# EAGLE schematic FranKinksTides (EAGLE 7.2.0)

## Sheet 1 of 7
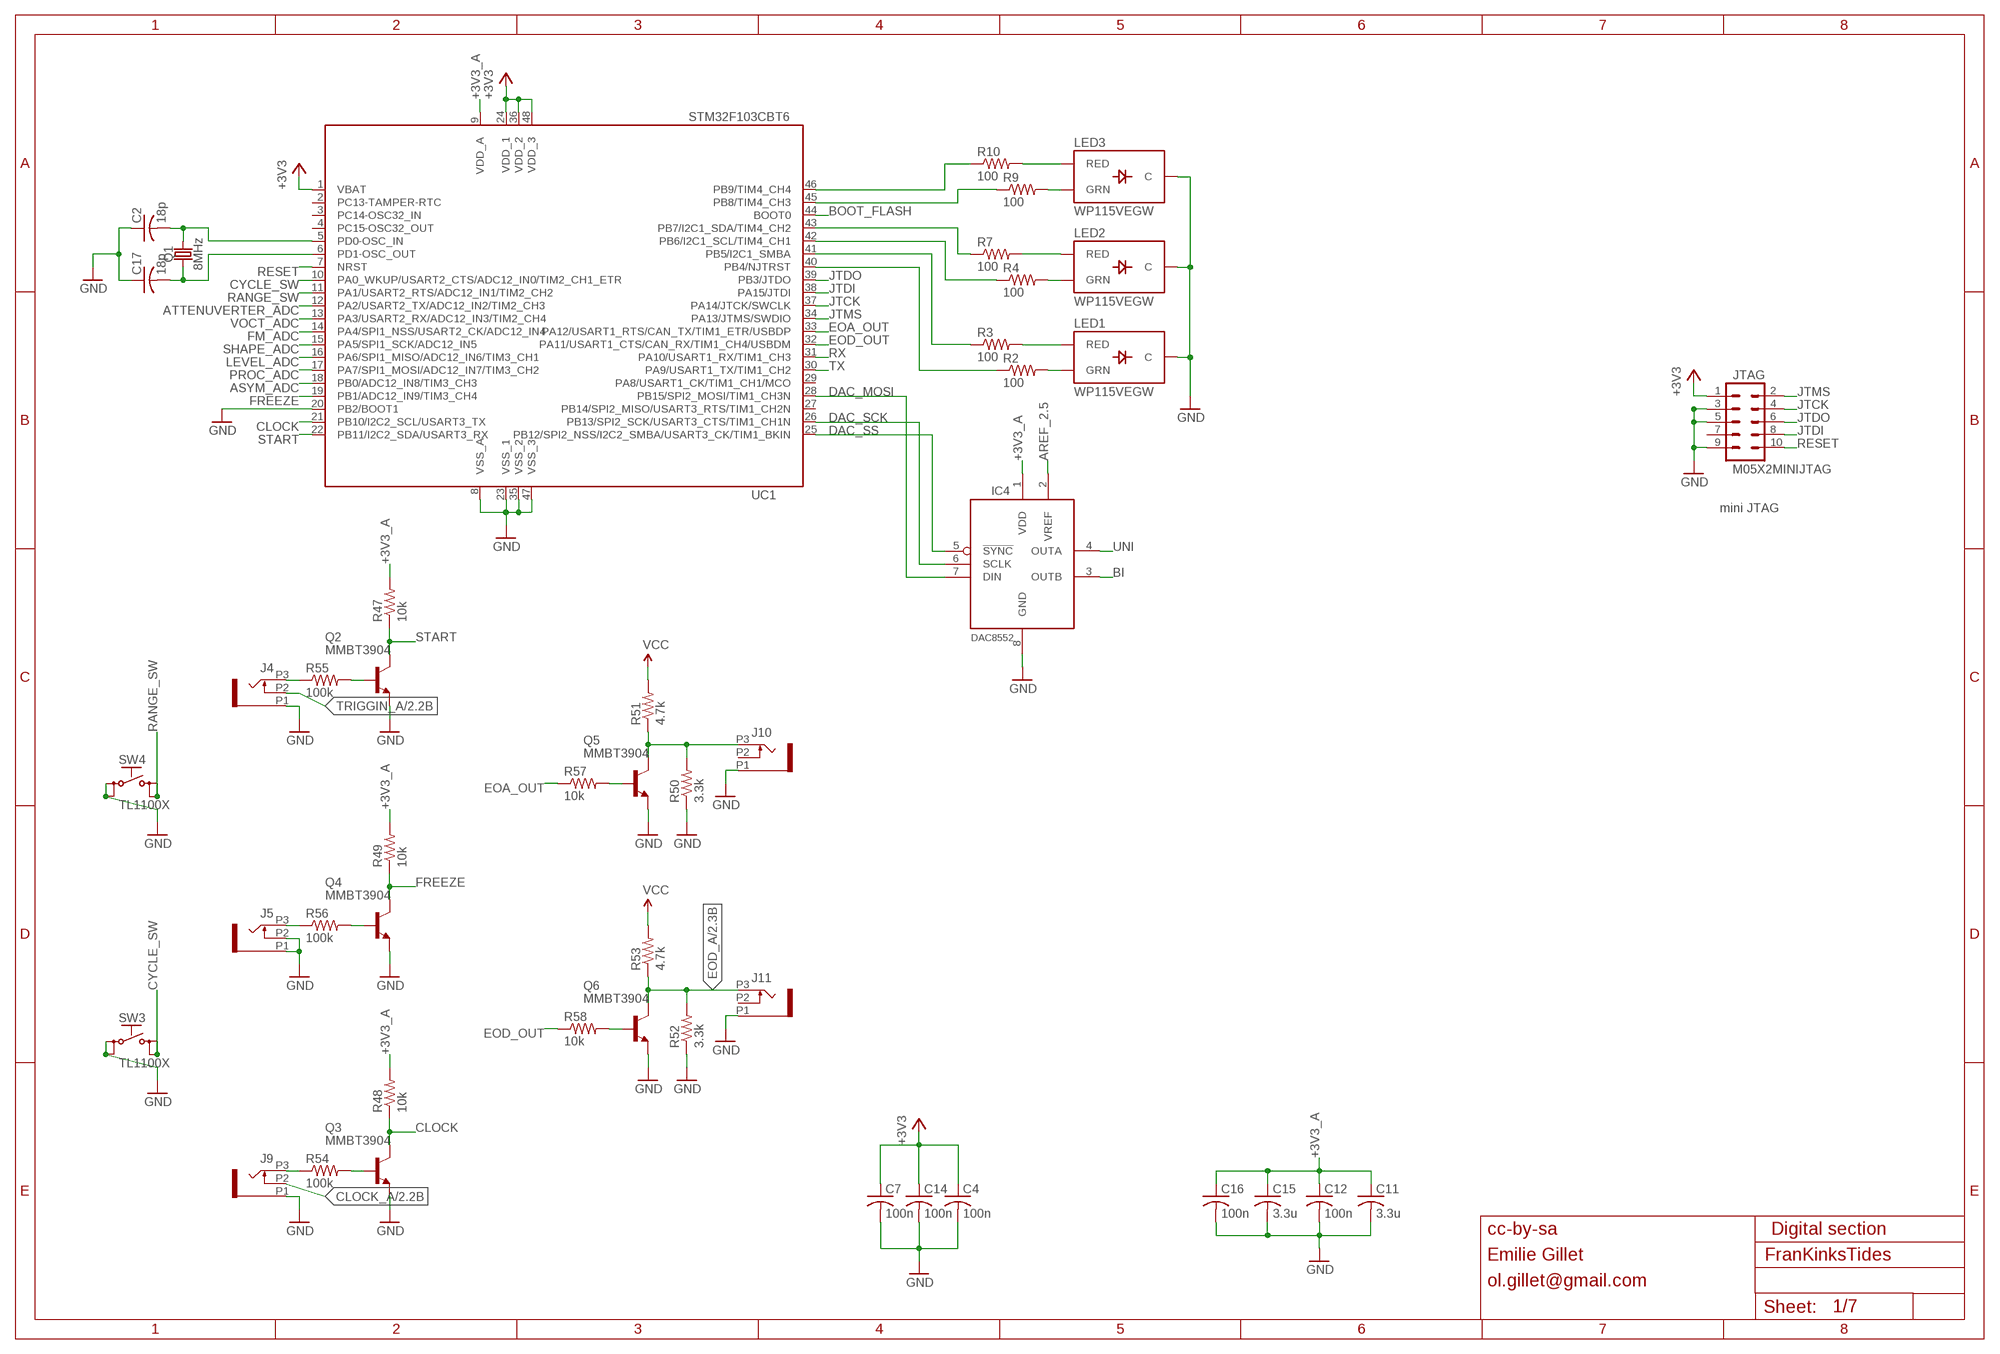
[diagram p0: schematic, sheet 1]

### Parts
C2  18p  C-USC0603  [C0603]
C4  100n  C-USC0603  [C0603]
C7  100n  C-USC0603  [C0603]
C11  3.3u  C-USC0603  [C0603]
C12  100n  C-USC0603  [C0603]
C14  100n  C-USC0603  [C0603]
C15  3.3u  C-USC0603  [C0603]
C16  100n  C-USC0603  [C0603]
C17  18p  C-USC0603  [C0603]
IC4  DAC8552  [MSOP-8]
J4  PJ301_GUI6  [OG-PJ301_VARIATIONS_WQP_PJ_301M6]
J5  PJ301_GUI6  [OG-PJ301_VARIATIONS_WQP_PJ_301M6]
J9  PJ301_GUI6  [OG-PJ301_VARIATIONS_WQP_PJ_301M6]
J10  PJ301_GUI6  [OG-PJ301_VARIATIONS_WQP_PJ_301M6]
J11  PJ301_GUI6  [OG-PJ301_VARIATIONS_WQP_PJ_301M6]
JTAG  M05X2MINIJTAG  [2X5-1.27]
LED1  WP115VEGW  LED-BICOLOR-THROUGHHOLE  [LED-BICOLOR-THROUGHHOLE]
LED2  WP115VEGW  LED-BICOLOR-THROUGHHOLE  [LED-BICOLOR-THROUGHHOLE]
LED3  WP115VEGW  LED-BICOLOR-THROUGHHOLE  [LED-BICOLOR-THROUGHHOLE]
Q1  8MHz  CRYSTAL-8MHZSMD-HC49UP  [HC49UP]
Q2  MMBT3904  MMBT3904LT1-NPN-SOT23-BEC  [SOT23-BEC]
Q3  MMBT3904  MMBT3904LT1-NPN-SOT23-BEC  [SOT23-BEC]
Q4  MMBT3904  MMBT3904LT1-NPN-SOT23-BEC  [SOT23-BEC]
Q5  MMBT3904  MMBT3904LT1-NPN-SOT23-BEC  [SOT23-BEC]
Q6  MMBT3904  MMBT3904LT1-NPN-SOT23-BEC  [SOT23-BEC]
R2  100  R-US_R0603  [R0603]
R3  100  R-US_R0603  [R0603]
R4  100  R-US_R0603  [R0603]
R7  100  R-US_R0603  [R0603]
R9  100  R-US_R0603  [R0603]
R10  100  R-US_R0603  [R0603]
R47  10k  R-US_R0603  [R0603]
R48  10k  R-US_R0603  [R0603]
R49  10k  R-US_R0603  [R0603]
R50  3.3k  R-US_R0603  [R0603]
R51  4.7k  R-US_R0603  [R0603]
R52  3.3k  R-US_R0603  [R0603]
R53  4.7k  R-US_R0603  [R0603]
R54  100k  R-US_R0603  [R0603]
R55  100k  R-US_R0603  [R0603]
R56  100k  R-US_R0603  [R0603]
R57  10k  R-US_R0603  [R0603]
R58  10k  R-US_R0603  [R0603]
SW3  TL1100X  [TL1100X]
SW4  TL1100X  [TL1100X]
UC1  STM32F103CBT6  STM32F103CB  [LQFP48]

### Nets
+3V3: C4.1 C7.1 C14.1 JTAG.1 UC1.1(VBAT) UC1.24(VDD_1) UC1.36(VDD_2) UC1.48(VDD_3) ; also sheet 3,4,6
+3V3_A: C11.1 C12.1 C15.1 C16.1 IC4.1(VDD) R47.2 R48.2 R49.2 UC1.9(VDD_A) ; also sheet 2,3,4,5,6
AREF_2.5: IC4.2(VREF) ; also sheet 3,4,6
ASYM_ADC: UC1.18(PB0/ADC12_IN8/TIM3_CH3) ; also sheet 2,4,5
ATTENUVERTER_ADC: UC1.12(PA2/USART2_TX/ADC12_IN2/TIM2_CH3) ; also sheet 2,4,5
BI: IC4.3(OUTB) ; also sheet 2,4,5
BOOT_FLASH: UC1.44(BOOT0) ; also sheet 4
CLOCK: Q3.C R48.1 UC1.21(PB10/I2C2_SCL/USART3_TX) ; also sheet 4
CLOCK_A: J9.P2 ; also sheet 2
CYCLE_SW: SW3.3(S) SW3.4(S1) UC1.10(PA0_WKUP/USART2_CTS/ADC12_IN0/TIM2_CH1_ETR) ; also sheet 4
DAC_MOSI: IC4.7(DIN) UC1.28(PB15/SPI2_MOSI/TIM1_CH3N) ; also sheet 4
DAC_SCK: IC4.6(SCLK) UC1.26(PB13/SPI2_SCK/USART3_CTS/TIM1_CH1N) ; also sheet 4
DAC_SS: IC4.5(!SYNC) UC1.25(PB12/SPI2_NSS/I2C2_SMBA/USART3_CK/TIM1_BKIN) ; also sheet 4
EOA_OUT: R57.1 UC1.33(PA12/USART1_RTS/CAN_TX/TIM1_ETR/USBDP) ; also sheet 4
EOD_A: J11.P3 Q6.C R52.2 R53.1 ; also sheet 2
EOD_OUT: R58.1 UC1.32(PA11/USART1_CTS/CAN_RX/TIM1_CH4/USBDM) ; also sheet 4
FM_ADC: UC1.14(PA4/SPI1_NSS/USART2_CK/ADC12_IN4) ; also sheet 2,4,5
FREEZE: Q4.C R49.1 UC1.19(PB1/ADC12_IN9/TIM3_CH4) ; also sheet 4
GND: C2.1 C4.2 C7.2 C11.2 C12.2 C14.2 C15.2 C16.2 C17.1 IC4.8(GND) J4.P1 J5.P1 J5.P2 J9.P1 J10.P1 J11.P1 JTAG.3 JTAG.5 JTAG.9 LED1.2(C) LED2.2(C) LED3.2(C) Q2.E Q3.E Q4.E Q5.E Q6.E R50.1 R52.1 SW3.1(P) SW3.2(P1) SW4.1(P) SW4.2(P1) UC1.8(VSS_A) UC1.20(PB2/BOOT1) UC1.23(VSS_1) UC1.35(VSS_2) UC1.47(VSS_3) ; also sheet 2,3,4,5,6,7
JTCK: JTAG.4 UC1.37(PA14/JTCK/SWCLK) ; also sheet 4
JTDI: JTAG.8 UC1.38(PA15/JTDI) ; also sheet 4
JTDO: JTAG.6 UC1.39(PB3/JTDO) ; also sheet 4
JTMS: JTAG.2 UC1.34(PA13/JTMS/SWDIO) ; also sheet 4
LEVEL_ADC: UC1.16(PA6/SPI1_MISO/ADC12_IN6/TIM3_CH1) ; also sheet 2,4,5
N$7: C2.2 Q1.2 UC1.5(PD0-OSC_IN)
N$8: C17.2 Q1.1 UC1.6(PD1-OSC_OUT)
N$18: J4.P3 R55.1
N$21: J5.P3 R56.1
N$23: Q4.B R56.2
N$24: J9.P3 R54.1
N$25: Q3.B R54.2
N$26: Q6.B R58.2
N$28: LED3.3(RED) R10.2
N$29: LED3.1(GRN) R9.2
N$30: LED2.3(RED) R7.2
N$31: LED2.1(GRN) R4.2
N$32: LED1.3(RED) R3.2
N$33: LED1.1(GRN) R2.2
N$34: R10.1 UC1.46(PB9/TIM4_CH4)
N$35: R9.1 UC1.45(PB8/TIM4_CH3)
N$36: R7.1 UC1.43(PB7/I2C1_SDA/TIM4_CH2)
N$37: R4.1 UC1.42(PB6/I2C1_SCL/TIM4_CH1)
N$38: R3.1 UC1.41(PB5/I2C1_SMBA)
N$39: R2.1 UC1.40(PB4/NJTRST)
N$44: J10.P3 Q5.C R50.2 R51.1
N$47: Q5.B R57.2
N$66: Q2.B R55.2
PROC_ADC: UC1.17(PA7/SPI1_MOSI/ADC12_IN7/TIM3_CH2) ; also sheet 2,4,5
RANGE_SW: SW4.3(S) SW4.4(S1) UC1.11(PA1/USART2_RTS/ADC12_IN1/TIM2_CH2) ; also sheet 4
RESET: JTAG.10 UC1.7(NRST) ; also sheet 4
RX: UC1.31(PA10/USART1_RX/TIM1_CH3) ; also sheet 4
SHAPE_ADC: UC1.15(PA5/SPI1_SCK/ADC12_IN5) ; also sheet 2,4,5
START: Q2.C R47.1 UC1.22(PB11/I2C2_SDA/USART3_RX) ; also sheet 4
TRIGGIN_A: J4.P2 ; also sheet 2
TX: UC1.30(PA9/USART1_TX/TIM1_CH2) ; also sheet 4
UNI: IC4.4(OUTA) ; also sheet 2,4,5
VCC: R51.2 R53.2 ; also sheet 2,3,4,5,6,7
VOCT_ADC: UC1.13(PA3/USART2_RX/ADC12_IN3/TIM2_CH4) ; also sheet 2,4,5
Unconnected: J10.P2 J11.P2 JTAG.7 UC1.2(PC13-TAMPER-RTC) UC1.3(PC14-OSC32_IN) UC1.4(PC15-OSC32_OUT) UC1.27(PB14/SPI2_MISO/USART3_RTS/TIM1_CH2N) UC1.29(PA8/USART1_CK/TIM1_CH1/MCO)

### Notes on the sheet
- mini JTAG
- cc-by-sa | Digital section
- Emilie Gillet
- ol.gillet@gmail.com

## Sheet 2 of 7
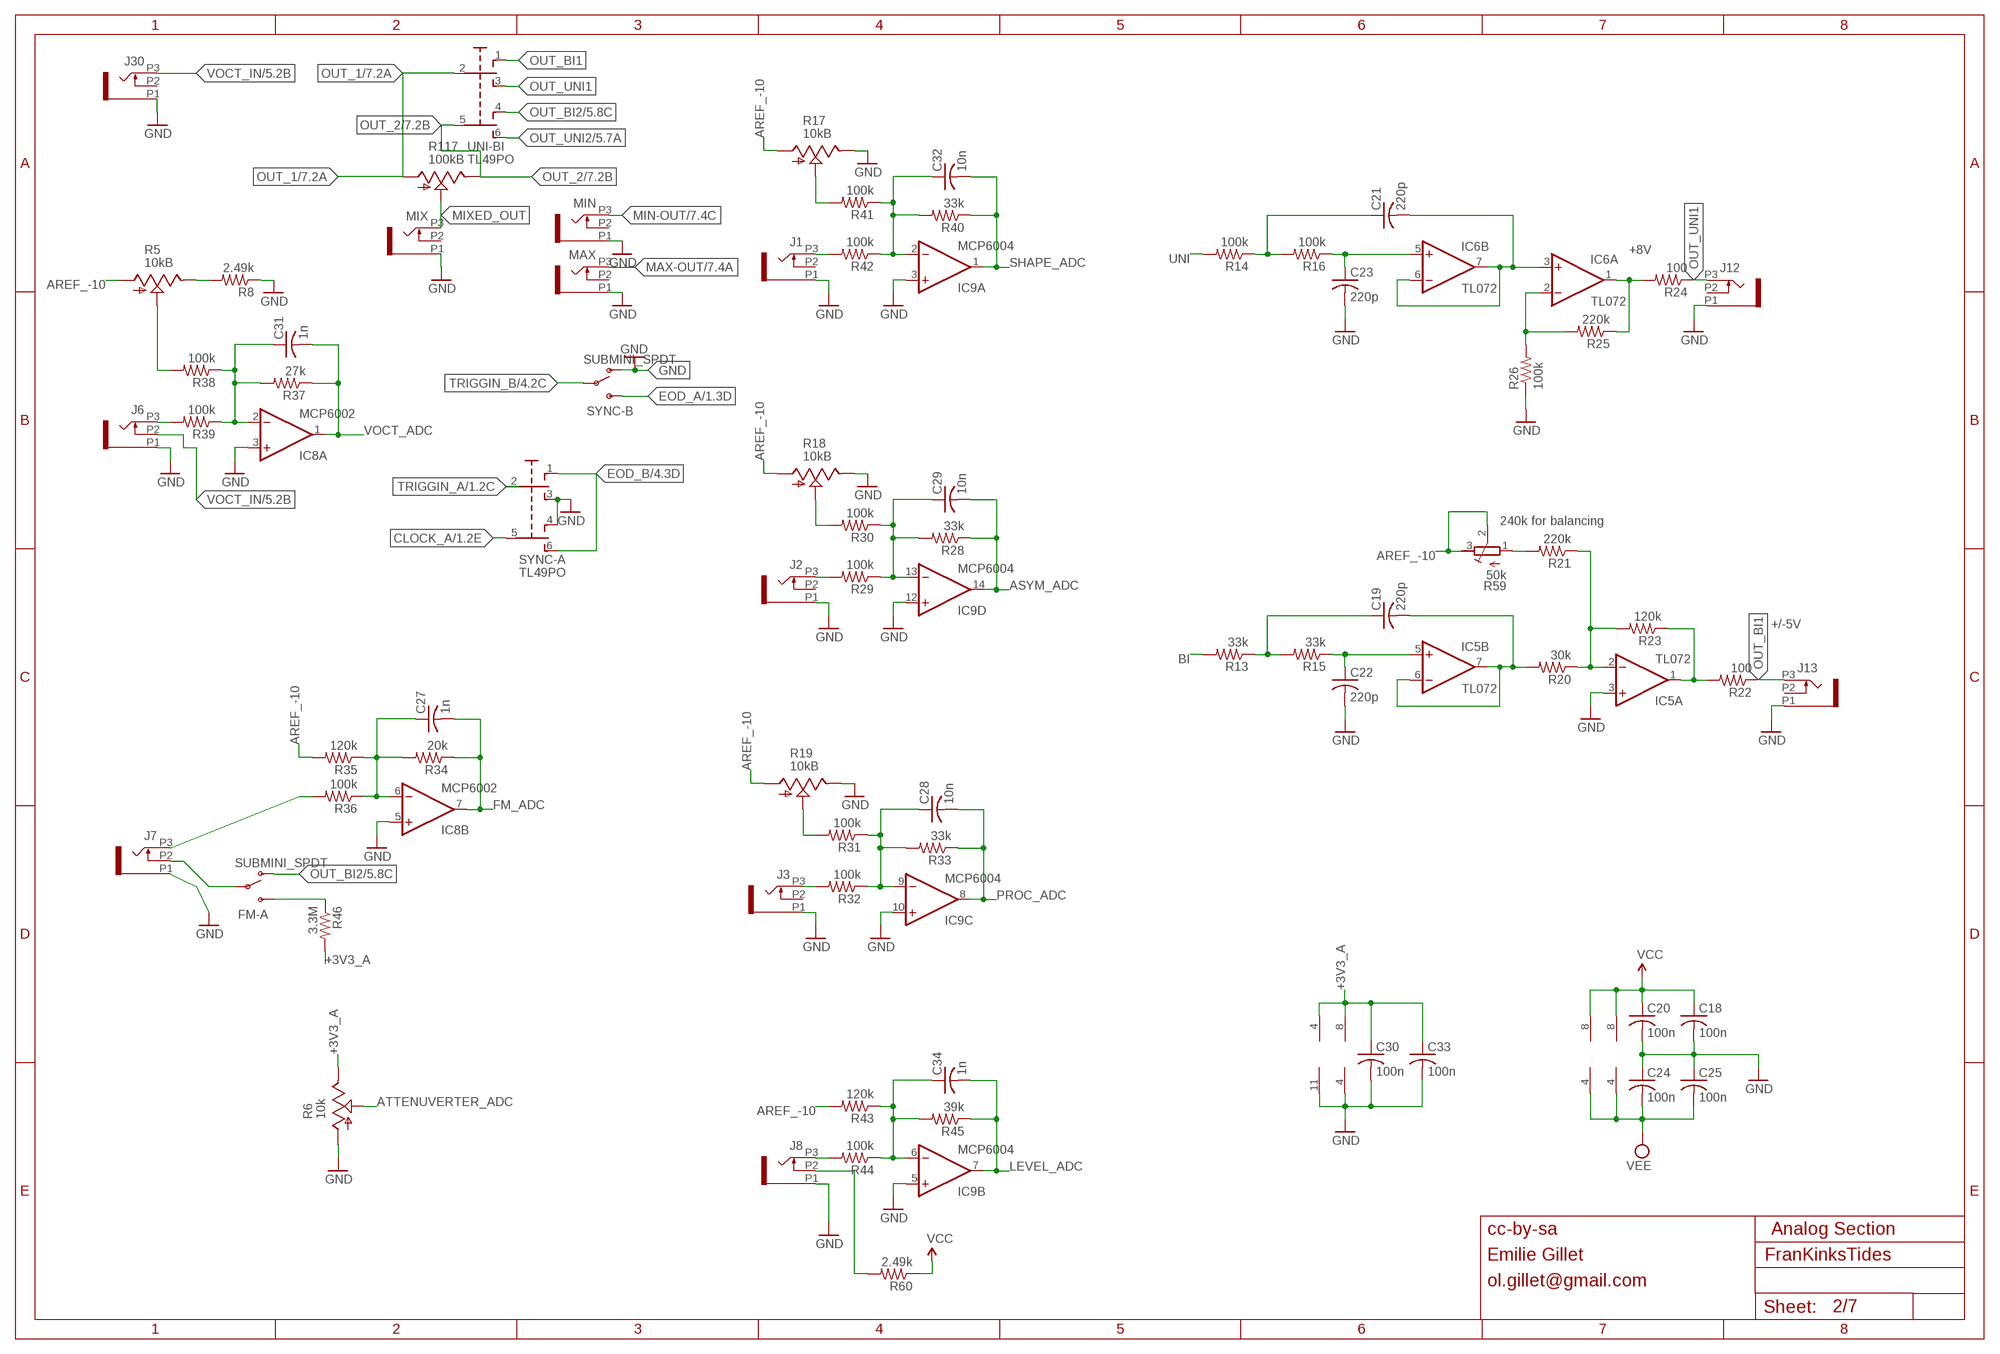
[diagram p1: schematic, sheet 2]

### Parts
C18  100n  C-USC0603  [C0603]
C19  220p  C-USC0603  [C0603]
C20  100n  C-USC0603  [C0603]
C21  220p  C-USC0603  [C0603]
C22  220p  C-USC0603  [C0603]
C23  220p  C-USC0603  [C0603]
C24  100n  C-USC0603  [C0603]
C25  100n  C-USC0603  [C0603]
C27  1n  C-USC0603  [C0603]
C28  10n  C-USC0603  [C0603]
C29  10n  C-USC0603  [C0603]
C30  100n  C-USC0603  [C0603]
C31  1n  C-USC0603  [C0603]
C32  10n  C-USC0603  [C0603]
C33  100n  C-USC0603  [C0603]
C34  1n  C-USC0603  [C0603]
FM-A  SUBMINI_SPDT  [SUBMINI_TOGGLE]
IC5  TL072  TL072TSSOP  [TSSOP-8]
IC6  TL072  TL072TSSOP  [TSSOP-8]
IC8  MCP6002  TL072D  [SO08]
IC9  MCP6004  MCP6004ST  [TSSOP14]
J1  PJ301_GUI6  [OG-PJ301_VARIATIONS_WQP_PJ_301M6]
J2  PJ301_GUI6  [OG-PJ301_VARIATIONS_WQP_PJ_301M6]
J3  PJ301_GUI6  [OG-PJ301_VARIATIONS_WQP_PJ_301M6]
J6  PJ301_GUI6  [OG-PJ301_VARIATIONS_WQP_PJ_301M6]
J7  PJ301_GUI6  [OG-PJ301_VARIATIONS_WQP_PJ_301M6]
J8  PJ301_GUI6  [OG-PJ301_VARIATIONS_WQP_PJ_301M6]
J12  PJ301_GUI6  [OG-PJ301_VARIATIONS_WQP_PJ_301M6]
J13  PJ301_GUI6  [OG-PJ301_VARIATIONS_WQP_PJ_301M6]
J30  PJ301_GUI6  [OG-PJ301_VARIATIONS_WQP_PJ_301M6]
MAX  PJ301_GUI6  [OG-PJ301_VARIATIONS_WQP_PJ_301M6]
MIN  PJ301_GUI6  [OG-PJ301_VARIATIONS_WQP_PJ_301M6]
MIX  PJ301_GUI6  [OG-PJ301_VARIATIONS_WQP_PJ_301M6]
R5  10kB  POT_USVERTICAL_PS  [ALPS_POT_VERTICAL_PS]
R6  10k  POT-ALPS_POT_US  [TALLTRIMMER]
R8  2.49k  R-US_R0603  [R0603]
R13  33k  R-US_R0603  [R0603]
R14  100k  R-US_R0603  [R0603]
R15  33k  R-US_R0603  [R0603]
R16  100k  R-US_R0603  [R0603]
R17  10kB  POT-ALPS_POT_US  [TALLTRIMMER]
R18  10kB  POT-ALPS_POT_US  [TALLTRIMMER]
R19  10kB  POT-ALPS_POT_US  [TALLTRIMMER]
R20  30k  R-US_R0603  [R0603]
R21  220k  R-US_R0603  [R0603]
R22  100  R-US_R0603  [R0603]
R23  120k  R-US_R0603  [R0603]
R24  100  R-US_R0603  [R0603]
R25  220k  R-US_R0603  [R0603]
R26  100k  R-US_R0603  [R0603]
R28  33k  R-US_R0603  [R0603]
R29  100k  R-US_R0603  [R0603]
R30  100k  R-US_R0603  [R0603]
R31  100k  R-US_R0603  [R0603]
R32  100k  R-US_R0603  [R0603]
R33  33k  R-US_R0603  [R0603]
R34  20k  R-US_R0603  [R0603]
R35  120k  R-US_R0603  [R0603]
R36  100k  R-US_R0603  [R0603]
R37  27k  R-US_R0603  [R0603]
R38  100k  R-US_R0603  [R0603]
R39  100k  R-US_R0603  [R0603]
R40  33k  R-US_R0603  [R0603]
R41  100k  R-US_R0603  [R0603]
R42  100k  R-US_R0603  [R0603]
R43  120k  R-US_R0603  [R0603]
R44  100k  R-US_R0603  [R0603]
R45  39k  R-US_R0603  [R0603]
R46  3.3M  R-US_R0603  [R0603]
R59  50k  R-TRIMM3296W  [RTRIM3296W]
R60  2.49k  R-US_R0805  [R0805]
R117  100kB  POT_USVERTICAL_PS  [ALPS_POT_VERTICAL_PS]
SYNC-A  TL49PO  [TL4XPO]
SYNC-B  SUBMINI_SPDT  [SUBMINI_TOGGLE]
UNI-BI  TL49PO  [TL4XPO]

### Nets
+3V3_A: C30.1 C33.1 IC8.8(P:V+) IC9.4(P:V+) R6.P$1(E) R46.2 ; also sheet 1,3,4,5,6
AREF_-10: R5.P$3(A) R17.P$3(A) R18.P$3(A) R19.P$3(A) R35.2 R43.2 R59.2(S) R59.3(E) ; also sheet 3,5,6
ASYM_ADC: C29.2 IC9.14(D:OUT) R28.1 ; also sheet 1,4,5
ATTENUVERTER_ADC: R6.P$2(S) ; also sheet 1,4,5
BI: R13.2 ; also sheet 1,4,5
BI_OUT: IC5.1(A:OUT) R22.2 R23.1
CLOCK_A: SYNC-A.5(P1) ; also sheet 1
EOD_A: SYNC-B.3(S) ; also sheet 1
EOD_B: SYNC-A.1(O) SYNC-A.6(S1) ; also sheet 4
F_CV: IC5.2(A:-IN) R20.1 R21.1 R23.2
FM_ADC: C27.2 IC8.7(B:OUT) R34.1 ; also sheet 1,4,5
GND: C18.2 C20.2 C22.2 C23.2 C24.1 C25.1 C30.2 C33.2 IC5.3(A:+IN) IC8.3(A:+IN) IC8.4(P:V-) IC8.5(B:+IN) IC9.3(A:+IN) IC9.5(B:+IN) IC9.10(C:+IN) IC9.11(P:V-) IC9.12(D:+IN) J1.P1 J2.P1 J3.P1 J6.P1 J7.P1 J8.P1 J12.P1 J13.P1 J30.P1 MAX.P1 MIN.P1 MIX.P1 R6.P$3(A) R8.1 R17.P$1(E) R18.P$1(E) R19.P$1(E) R26.1 SYNC-A.3(S) SYNC-A.4(O1) SYNC-B.1(O) ; also sheet 1,3,4,5,6,7
LEVEL_ADC: C34.2 IC9.7(B:OUT) R45.1 ; also sheet 1,4,5
MAX-OUT: MAX.P3 ; also sheet 7
MIN-OUT: MIN.P3 ; also sheet 7
MIXED_OUT: MIX.P3 R117.P$2(S)
N$1: J1.P3 R42.2
N$2: C32.1 IC9.2(A:-IN) R40.2 R41.1 R42.1
N$3: R17.P$2(S) R41.2
N$4: J2.P3 R29.2
N$5: C29.1 IC9.13(D:-IN) R28.2 R29.1 R30.1
N$6: FM-A.3(S) R46.1
N$9: R18.P$2(S) R30.2
N$10: J3.P3 R32.2
N$11: C28.1 IC9.9(C:-IN) R31.1 R32.1 R33.2
N$12: R19.P$2(S) R31.2
N$13: J8.P3 R44.2
N$14: C34.1 IC9.6(B:-IN) R43.1 R44.1 R45.2
N$15: J6.P3 R39.2
N$16: C31.1 IC8.2(A:-IN) R37.2 R38.1 R39.1
N$17: R5.P$2(S) R38.2
N$19: R5.P$1(E) R8.2
N$20: J7.P3 R36.2
N$22: C27.1 IC8.6(B:-IN) R34.2 R35.1 R36.1
N$27: FM-A.COM(COMMON) J7.P2
N$40: R21.2 R59.1(A)
N$41: IC6.2(A:-IN) R25.2 R26.2
N$42: C19.2 IC5.6(B:-IN) IC5.7(B:OUT) R20.2
N$43: C22.1 IC5.5(B:+IN) R15.1
N$45: C19.1 R13.1 R15.2
N$46: IC6.1(A:OUT) R24.2 R25.1
N$48: J8.P2 R60.2
N$67: C21.2 IC6.3(A:+IN) IC6.6(B:-IN) IC6.7(B:OUT)
N$69: C23.1 IC6.5(B:+IN) R16.1
N$71: C21.1 R14.1 R16.2
OUT_1: R117.P$3(A) UNI-BI.2(P) ; also sheet 7
OUT_2: R117.P$1(E) UNI-BI.5(P1) ; also sheet 7
OUT_BI1: J13.P3 R22.1 UNI-BI.1(O)
OUT_BI2: FM-A.1(O) UNI-BI.4(O1) ; also sheet 5
OUT_UNI1: J12.P3 R24.1 UNI-BI.3(S)
OUT_UNI2: UNI-BI.6(S1) ; also sheet 5
PROC_ADC: C28.2 IC9.8(C:OUT) R33.1 ; also sheet 1,4,5
SHAPE_ADC: C32.2 IC9.1(A:OUT) R40.1 ; also sheet 1,4,5
TRIGGIN_A: SYNC-A.2(P) ; also sheet 1
TRIGGIN_B: SYNC-B.COM(COMMON) ; also sheet 4
UNI: R14.2 ; also sheet 1,4,5
VCC: C18.1 C20.1 IC5.8(P:V+) IC6.8(P:V+) R60.1 ; also sheet 1,3,4,5,6,7
VEE: C24.2 C25.2 IC5.4(P:V-) IC6.4(P:V-) ; also sheet 3,5,6,7
VOCT_ADC: C31.2 IC8.1(A:OUT) R37.1 ; also sheet 1,4,5
VOCT_IN: J6.P2 J30.P3 ; also sheet 5
Unconnected: J1.P2 J2.P2 J3.P2 J12.P2 J13.P2 J30.P2 MAX.P2 MIN.P2 MIX.P2

### Notes on the sheet
- +8V
- 240k for balancing
- +/-5V
- cc-by-sa | Analog Section
- Emilie Gillet
- ol.gillet@gmail.com

## Sheet 3 of 7
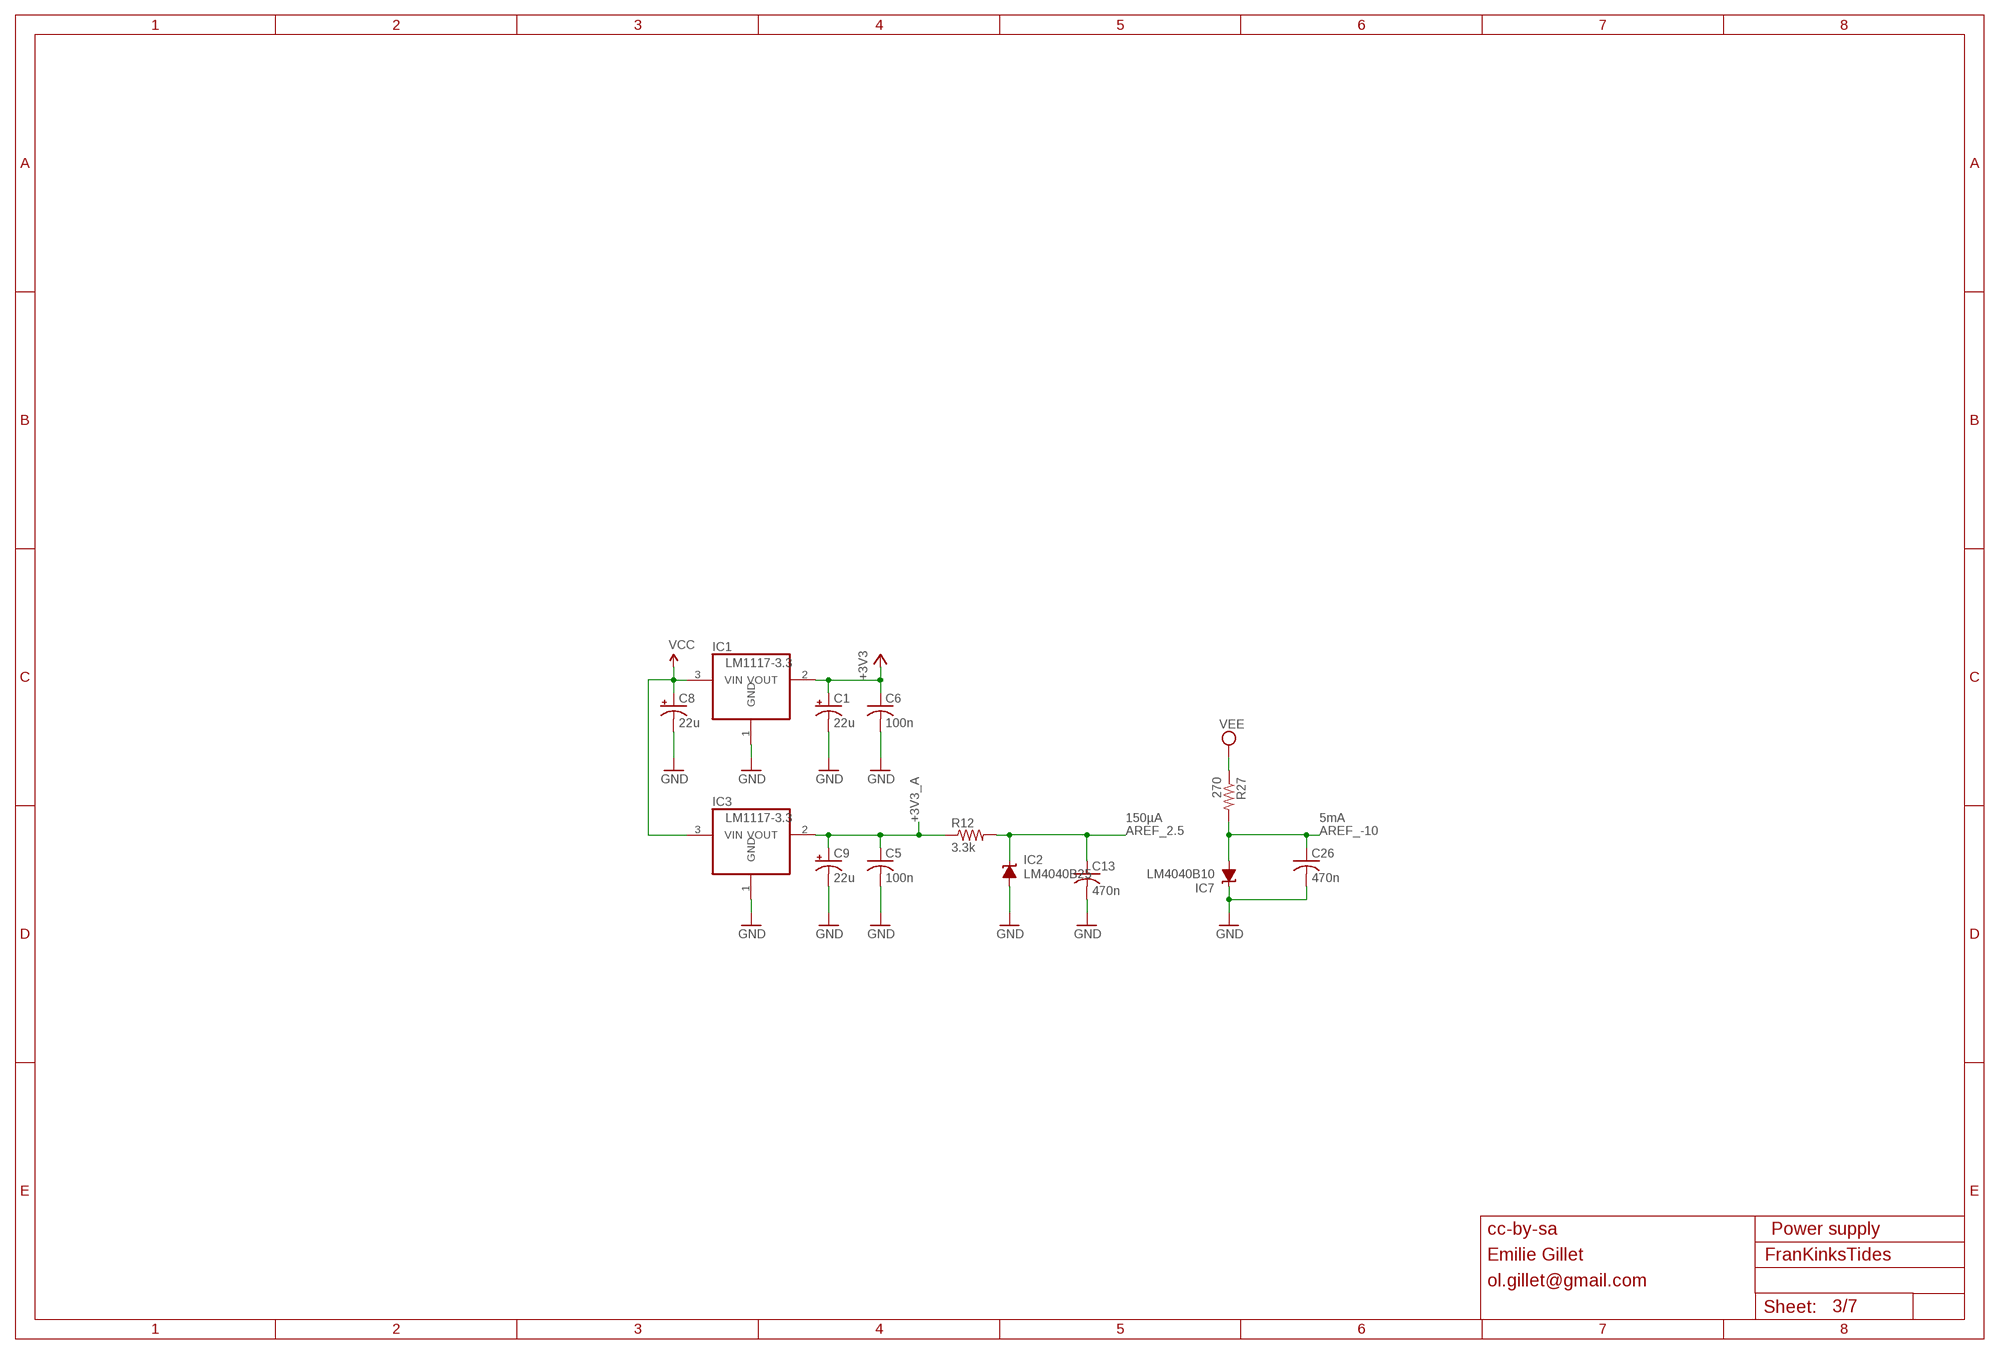
[diagram p2: schematic, sheet 3]

### Parts
C1  22u  CPOL-USC  [PANASONIC_C]
C5  100n  C-USC0603  [C0603]
C6  100n  C-USC0603  [C0603]
C8  22u  CPOL-USC  [PANASONIC_C]
C9  22u  CPOL-USC  [PANASONIC_C]
C13  470n  C-USC0603  [C0603]
C26  470n  C-USC0603  [C0603]
IC1  LM1117-3.3  REG1117  [SOT223]
IC2  LM4040B25  LM4041B12DBZ  [DBZ_R-PDSO-G3]
IC3  LM1117-3.3  REG1117  [SOT223]
IC7  LM4040B10  LM4041B12DBZ  [DBZ_R-PDSO-G3]
R12  3.3k  R-US_R0603  [R0603]
R27  270  R-US_R0603  [R0603]

### Nets
+3V3: C1.+ C6.1 IC1.2(VOUT) ; also sheet 1,4,6
+3V3_A: C5.1 C9.+ IC3.2(VOUT) R12.1 ; also sheet 1,2,4,5,6
AREF_2.5: C13.1 IC2.1(C) R12.2 ; also sheet 1,4,6
AREF_-10: C26.1 IC7.2(A) R27.2 ; also sheet 2,5,6
GND: C1.- C5.2 C6.2 C8.- C9.- C13.2 C26.2 IC1.1(GND) IC2.2(A) IC3.1(GND) IC7.1(C) ; also sheet 1,2,4,5,6,7
VCC: C8.+ IC1.3(VIN) IC3.3(VIN) ; also sheet 1,2,4,5,6,7
VEE: R27.1 ; also sheet 2,5,6,7

### Notes on the sheet
- 150µA | 5mA
- cc-by-sa | Power supply
- Emilie Gillet
- ol.gillet@gmail.com

## Sheet 4 of 7
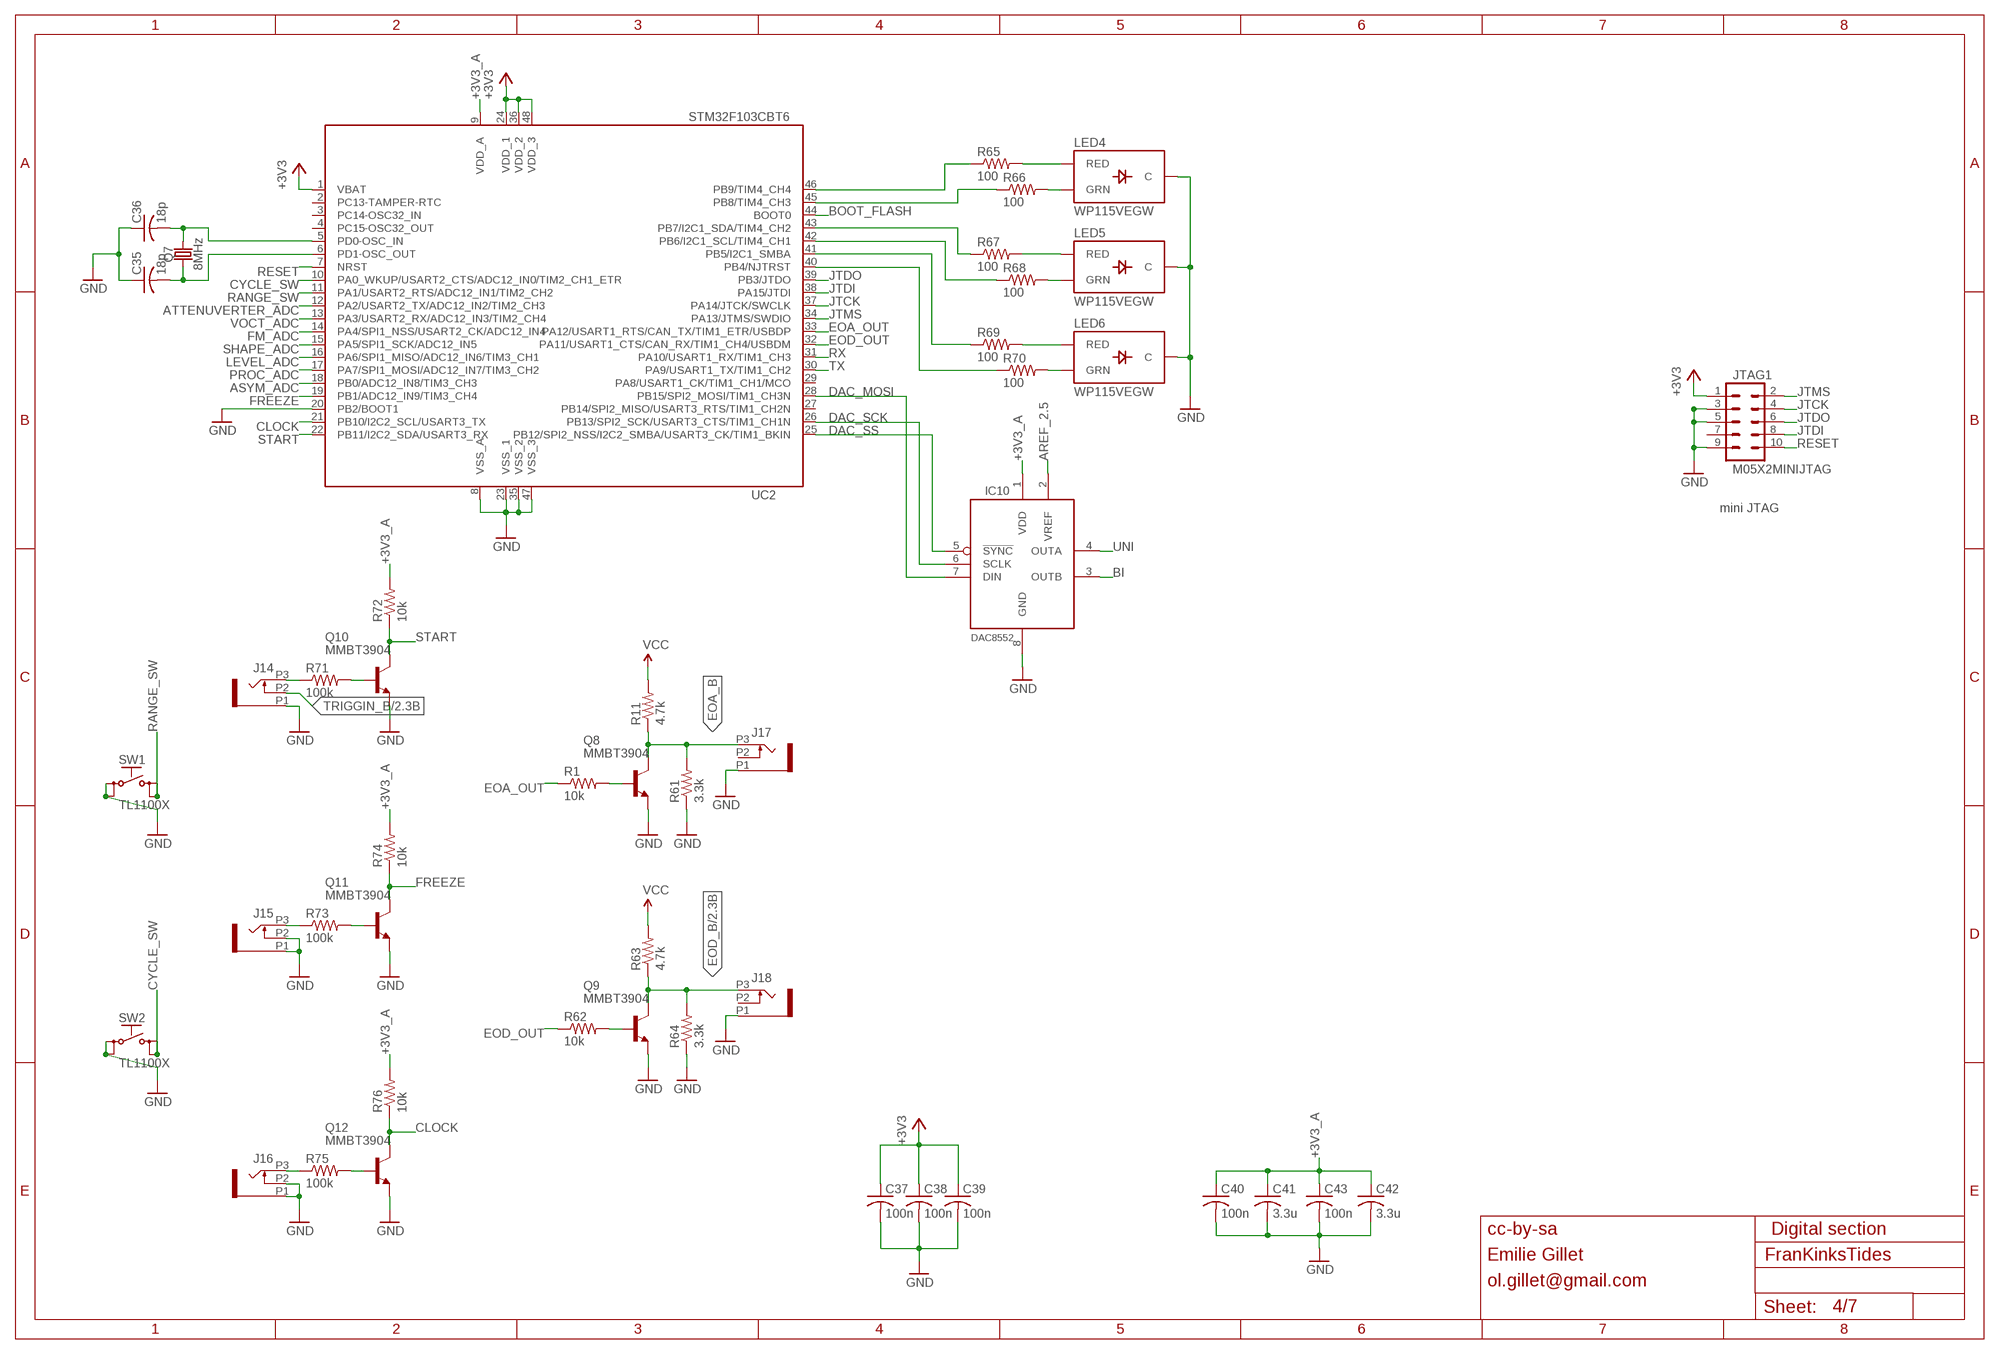
[diagram p3: schematic, sheet 4]

### Parts
C35  18p  C-USC0603  [C0603]
C36  18p  C-USC0603  [C0603]
C37  100n  C-USC0603  [C0603]
C38  100n  C-USC0603  [C0603]
C39  100n  C-USC0603  [C0603]
C40  100n  C-USC0603  [C0603]
C41  3.3u  C-USC0603  [C0603]
C42  3.3u  C-USC0603  [C0603]
C43  100n  C-USC0603  [C0603]
IC10  DAC8552  [MSOP-8]
J14  PJ301_GUI6  [OG-PJ301_VARIATIONS_WQP_PJ_301M6]
J15  PJ301_GUI6  [OG-PJ301_VARIATIONS_WQP_PJ_301M6]
J16  PJ301_GUI6  [OG-PJ301_VARIATIONS_WQP_PJ_301M6]
J17  PJ301_GUI6  [OG-PJ301_VARIATIONS_WQP_PJ_301M6]
J18  PJ301_GUI6  [OG-PJ301_VARIATIONS_WQP_PJ_301M6]
JTAG1  M05X2MINIJTAG  [2X5-1.27]
LED4  WP115VEGW  LED-BICOLOR-THROUGHHOLE  [LED-BICOLOR-THROUGHHOLE]
LED5  WP115VEGW  LED-BICOLOR-THROUGHHOLE  [LED-BICOLOR-THROUGHHOLE]
LED6  WP115VEGW  LED-BICOLOR-THROUGHHOLE  [LED-BICOLOR-THROUGHHOLE]
Q7  8MHz  CRYSTAL-8MHZSMD-HC49UP  [HC49UP]
Q8  MMBT3904  MMBT3904LT1-NPN-SOT23-BEC  [SOT23-BEC]
Q9  MMBT3904  MMBT3904LT1-NPN-SOT23-BEC  [SOT23-BEC]
Q10  MMBT3904  MMBT3904LT1-NPN-SOT23-BEC  [SOT23-BEC]
Q11  MMBT3904  MMBT3904LT1-NPN-SOT23-BEC  [SOT23-BEC]
Q12  MMBT3904  MMBT3904LT1-NPN-SOT23-BEC  [SOT23-BEC]
R1  10k  R-US_R0603  [R0603]
R11  4.7k  R-US_R0603  [R0603]
R61  3.3k  R-US_R0603  [R0603]
R62  10k  R-US_R0603  [R0603]
R63  4.7k  R-US_R0603  [R0603]
R64  3.3k  R-US_R0603  [R0603]
R65  100  R-US_R0603  [R0603]
R66  100  R-US_R0603  [R0603]
R67  100  R-US_R0603  [R0603]
R68  100  R-US_R0603  [R0603]
R69  100  R-US_R0603  [R0603]
R70  100  R-US_R0603  [R0603]
R71  100k  R-US_R0603  [R0603]
R72  10k  R-US_R0603  [R0603]
R73  100k  R-US_R0603  [R0603]
R74  10k  R-US_R0603  [R0603]
R75  100k  R-US_R0603  [R0603]
R76  10k  R-US_R0603  [R0603]
SW1  TL1100X  [TL1100X]
SW2  TL1100X  [TL1100X]
UC2  STM32F103CBT6  STM32F103CB  [LQFP48]

### Nets
+3V3: C37.1 C38.1 C39.1 JTAG1.1 UC2.1(VBAT) UC2.24(VDD_1) UC2.36(VDD_2) UC2.48(VDD_3) ; also sheet 1,3,6
+3V3_A: C40.1 C41.1 C42.1 C43.1 IC10.1(VDD) R72.2 R74.2 R76.2 UC2.9(VDD_A) ; also sheet 1,2,3,5,6
AREF_2.5: IC10.2(VREF) ; also sheet 1,3,6
ASYM_ADC: UC2.18(PB0/ADC12_IN8/TIM3_CH3) ; also sheet 1,2,5
ATTENUVERTER_ADC: UC2.12(PA2/USART2_TX/ADC12_IN2/TIM2_CH3) ; also sheet 1,2,5
BI: IC10.3(OUTB) ; also sheet 1,2,5
BOOT_FLASH: UC2.44(BOOT0) ; also sheet 1
CLOCK: Q12.C R76.1 UC2.21(PB10/I2C2_SCL/USART3_TX) ; also sheet 1
CYCLE_SW: SW2.3(S) SW2.4(S1) UC2.10(PA0_WKUP/USART2_CTS/ADC12_IN0/TIM2_CH1_ETR) ; also sheet 1
DAC_MOSI: IC10.7(DIN) UC2.28(PB15/SPI2_MOSI/TIM1_CH3N) ; also sheet 1
DAC_SCK: IC10.6(SCLK) UC2.26(PB13/SPI2_SCK/USART3_CTS/TIM1_CH1N) ; also sheet 1
DAC_SS: IC10.5(!SYNC) UC2.25(PB12/SPI2_NSS/I2C2_SMBA/USART3_CK/TIM1_BKIN) ; also sheet 1
EOA_B: J17.P3 Q8.C R11.1 R61.2
EOA_OUT: R1.1 UC2.33(PA12/USART1_RTS/CAN_TX/TIM1_ETR/USBDP) ; also sheet 1
EOD_B: J18.P3 Q9.C R63.1 R64.2 ; also sheet 2
EOD_OUT: R62.1 UC2.32(PA11/USART1_CTS/CAN_RX/TIM1_CH4/USBDM) ; also sheet 1
FM_ADC: UC2.14(PA4/SPI1_NSS/USART2_CK/ADC12_IN4) ; also sheet 1,2,5
FREEZE: Q11.C R74.1 UC2.19(PB1/ADC12_IN9/TIM3_CH4) ; also sheet 1
GND: C35.1 C36.1 C37.2 C38.2 C39.2 C40.2 C41.2 C42.2 C43.2 IC10.8(GND) J14.P1 J15.P1 J15.P2 J16.P1 J16.P2 J17.P1 J18.P1 JTAG1.3 JTAG1.5 JTAG1.9 LED4.2(C) LED5.2(C) LED6.2(C) Q8.E Q9.E Q10.E Q11.E Q12.E R61.1 R64.1 SW1.1(P) SW1.2(P1) SW2.1(P) SW2.2(P1) UC2.8(VSS_A) UC2.20(PB2/BOOT1) UC2.23(VSS_1) UC2.35(VSS_2) UC2.47(VSS_3) ; also sheet 1,2,3,5,6,7
JTCK: JTAG1.4 UC2.37(PA14/JTCK/SWCLK) ; also sheet 1
JTDI: JTAG1.8 UC2.38(PA15/JTDI) ; also sheet 1
JTDO: JTAG1.6 UC2.39(PB3/JTDO) ; also sheet 1
JTMS: JTAG1.2 UC2.34(PA13/JTMS/SWDIO) ; also sheet 1
LEVEL_ADC: UC2.16(PA6/SPI1_MISO/ADC12_IN6/TIM3_CH1) ; also sheet 1,2,5
N$49: C36.2 Q7.2 UC2.5(PD0-OSC_IN)
N$50: C35.2 Q7.1 UC2.6(PD1-OSC_OUT)
N$51: Q8.B R1.2
N$53: Q9.B R62.2
N$55: LED4.3(RED) R65.2
N$58: LED4.1(GRN) R66.2
N$59: LED5.3(RED) R67.2
N$60: LED5.1(GRN) R68.2
N$61: LED6.3(RED) R69.2
N$62: LED6.1(GRN) R70.2
N$63: R65.1 UC2.46(PB9/TIM4_CH4)
N$65: R66.1 UC2.45(PB8/TIM4_CH3)
N$68: R67.1 UC2.43(PB7/I2C1_SDA/TIM4_CH2)
N$70: R68.1 UC2.42(PB6/I2C1_SCL/TIM4_CH1)
N$72: R69.1 UC2.41(PB5/I2C1_SMBA)
N$73: R70.1 UC2.40(PB4/NJTRST)
N$74: J14.P3 R71.1
N$75: Q10.B R71.2
N$76: J15.P3 R73.1
N$77: Q11.B R73.2
N$78: J16.P3 R75.1
N$79: Q12.B R75.2
PROC_ADC: UC2.17(PA7/SPI1_MOSI/ADC12_IN7/TIM3_CH2) ; also sheet 1,2,5
RANGE_SW: SW1.3(S) SW1.4(S1) UC2.11(PA1/USART2_RTS/ADC12_IN1/TIM2_CH2) ; also sheet 1
RESET: JTAG1.10 UC2.7(NRST) ; also sheet 1
RX: UC2.31(PA10/USART1_RX/TIM1_CH3) ; also sheet 1
SHAPE_ADC: UC2.15(PA5/SPI1_SCK/ADC12_IN5) ; also sheet 1,2,5
START: Q10.C R72.1 UC2.22(PB11/I2C2_SDA/USART3_RX) ; also sheet 1
TRIGGIN_B: J14.P2 ; also sheet 2
TX: UC2.30(PA9/USART1_TX/TIM1_CH2) ; also sheet 1
UNI: IC10.4(OUTA) ; also sheet 1,2,5
VCC: R11.2 R63.2 ; also sheet 1,2,3,5,6,7
VOCT_ADC: UC2.13(PA3/USART2_RX/ADC12_IN3/TIM2_CH4) ; also sheet 1,2,5
Unconnected: J17.P2 J18.P2 JTAG1.7 UC2.2(PC13-TAMPER-RTC) UC2.3(PC14-OSC32_IN) UC2.4(PC15-OSC32_OUT) UC2.27(PB14/SPI2_MISO/USART3_RTS/TIM1_CH2N) UC2.29(PA8/USART1_CK/TIM1_CH1/MCO)

### Notes on the sheet
- mini JTAG
- cc-by-sa | Digital section
- Emilie Gillet
- ol.gillet@gmail.com

## Sheet 5 of 7
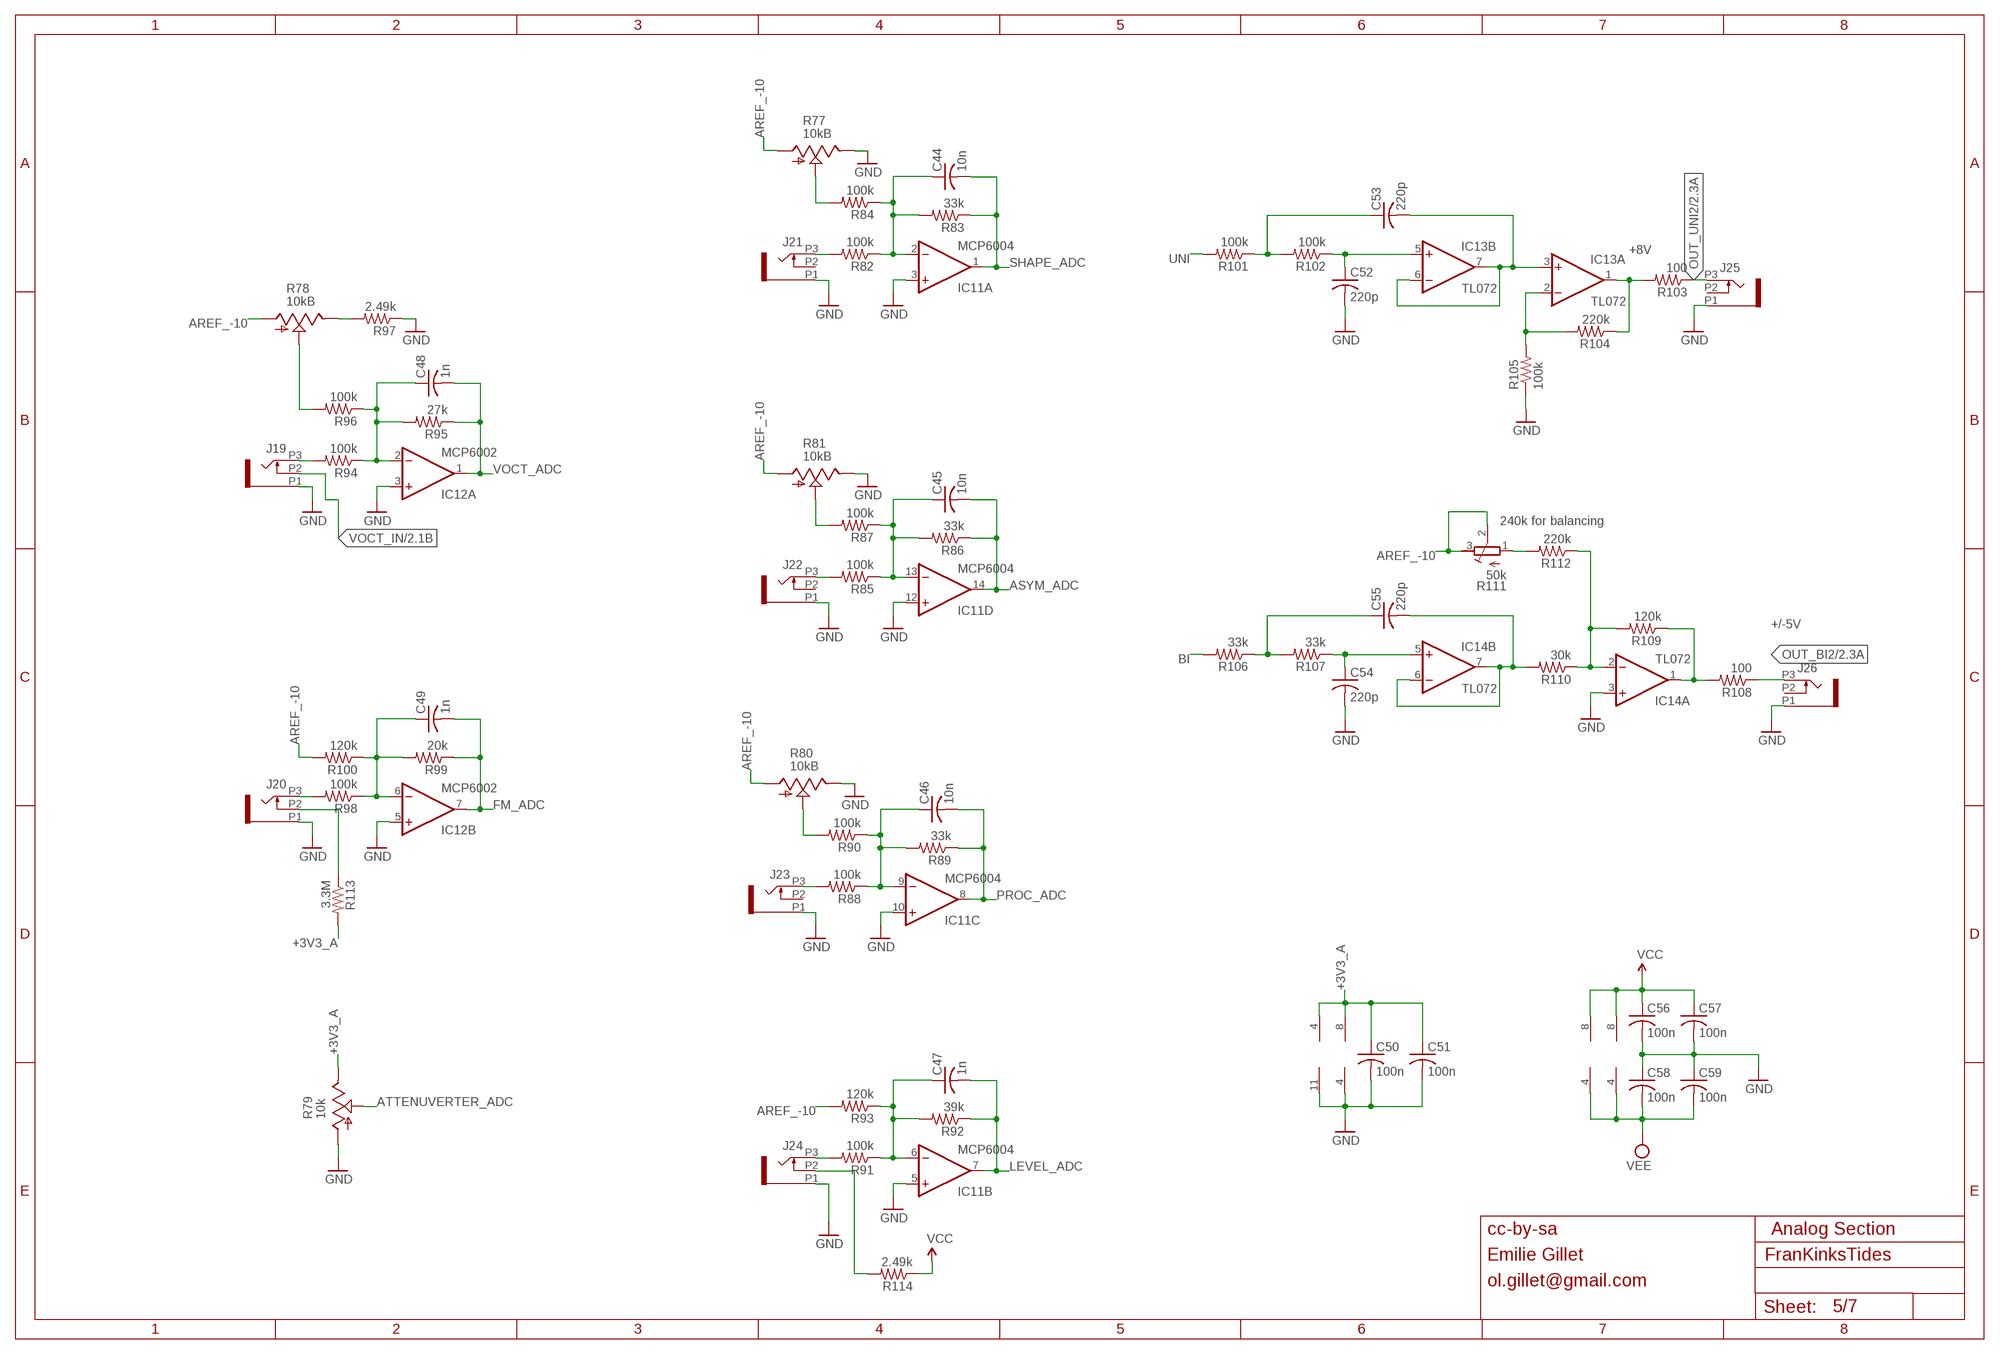
[diagram p4: schematic, sheet 5]

### Parts
C44  10n  C-USC0603  [C0603]
C45  10n  C-USC0603  [C0603]
C46  10n  C-USC0603  [C0603]
C47  1n  C-USC0603  [C0603]
C48  1n  C-USC0603  [C0603]
C49  1n  C-USC0603  [C0603]
C50  100n  C-USC0603  [C0603]
C51  100n  C-USC0603  [C0603]
C52  220p  C-USC0603  [C0603]
C53  220p  C-USC0603  [C0603]
C54  220p  C-USC0603  [C0603]
C55  220p  C-USC0603  [C0603]
C56  100n  C-USC0603  [C0603]
C57  100n  C-USC0603  [C0603]
C58  100n  C-USC0603  [C0603]
C59  100n  C-USC0603  [C0603]
IC11  MCP6004  MCP6004ST  [TSSOP14]
IC12  MCP6002  TL072D  [SO08]
IC13  TL072  TL072TSSOP  [TSSOP-8]
IC14  TL072  TL072TSSOP  [TSSOP-8]
J19  PJ301_GUI6  [OG-PJ301_VARIATIONS_WQP_PJ_301M6]
J20  PJ301_GUI6  [OG-PJ301_VARIATIONS_WQP_PJ_301M6]
J21  PJ301_GUI6  [OG-PJ301_VARIATIONS_WQP_PJ_301M6]
J22  PJ301_GUI6  [OG-PJ301_VARIATIONS_WQP_PJ_301M6]
J23  PJ301_GUI6  [OG-PJ301_VARIATIONS_WQP_PJ_301M6]
J24  PJ301_GUI6  [OG-PJ301_VARIATIONS_WQP_PJ_301M6]
J25  PJ301_GUI6  [OG-PJ301_VARIATIONS_WQP_PJ_301M6]
J26  PJ301_GUI6  [OG-PJ301_VARIATIONS_WQP_PJ_301M6]
R77  10kB  POT-ALPS_POT_US  [TALLTRIMMER]
R78  10kB  POT_USVERTICAL_PS  [ALPS_POT_VERTICAL_PS]
R79  10k  POT-ALPS_POT_US  [TALLTRIMMER]
R80  10kB  POT-ALPS_POT_US  [TALLTRIMMER]
R81  10kB  POT-ALPS_POT_US  [TALLTRIMMER]
R82  100k  R-US_R0603  [R0603]
R83  33k  R-US_R0603  [R0603]
R84  100k  R-US_R0603  [R0603]
R85  100k  R-US_R0603  [R0603]
R86  33k  R-US_R0603  [R0603]
R87  100k  R-US_R0603  [R0603]
R88  100k  R-US_R0603  [R0603]
R89  33k  R-US_R0603  [R0603]
R90  100k  R-US_R0603  [R0603]
R91  100k  R-US_R0603  [R0603]
R92  39k  R-US_R0603  [R0603]
R93  120k  R-US_R0603  [R0603]
R94  100k  R-US_R0603  [R0603]
R95  27k  R-US_R0603  [R0603]
R96  100k  R-US_R0603  [R0603]
R97  2.49k  R-US_R0603  [R0603]
R98  100k  R-US_R0603  [R0603]
R99  20k  R-US_R0603  [R0603]
R100  120k  R-US_R0603  [R0603]
R101  100k  R-US_R0603  [R0603]
R102  100k  R-US_R0603  [R0603]
R103  100  R-US_R0603  [R0603]
R104  220k  R-US_R0603  [R0603]
R105  100k  R-US_R0603  [R0603]
R106  33k  R-US_R0603  [R0603]
R107  33k  R-US_R0603  [R0603]
R108  100  R-US_R0603  [R0603]
R109  120k  R-US_R0603  [R0603]
R110  30k  R-US_R0603  [R0603]
R111  50k  R-TRIMM3296W  [RTRIM3296W]
R112  220k  R-US_R0603  [R0603]
R113  3.3M  R-US_R0603  [R0603]
R114  2.49k  R-US_R0805  [R0805]

### Nets
+3V3_A: C50.1 C51.1 IC11.4(P:V+) IC12.8(P:V+) R79.P$1(E) R113.2 ; also sheet 1,2,3,4,6
AREF_-10: R77.P$3(A) R78.P$3(A) R80.P$3(A) R81.P$3(A) R93.2 R100.2 R111.2(S) R111.3(E) ; also sheet 2,3,6
ASYM_ADC: C45.2 IC11.14(D:OUT) R86.1 ; also sheet 1,2,4
ATTENUVERTER_ADC: R79.P$2(S) ; also sheet 1,2,4
BI: R106.2 ; also sheet 1,2,4
BI_OUT1: IC14.1(A:OUT) R108.2 R109.1
F_CV1: IC14.2(A:-IN) R109.2 R110.1 R112.1
FM_ADC: C49.2 IC12.7(B:OUT) R99.1 ; also sheet 1,2,4
GND: C50.2 C51.2 C52.2 C54.2 C56.2 C57.2 C58.1 C59.1 IC11.3(A:+IN) IC11.5(B:+IN) IC11.10(C:+IN) IC11.11(P:V-) IC11.12(D:+IN) IC12.3(A:+IN) IC12.4(P:V-) IC12.5(B:+IN) IC14.3(A:+IN) J19.P1 J20.P1 J21.P1 J22.P1 J23.P1 J24.P1 J25.P1 J26.P1 R77.P$1(E) R79.P$3(A) R80.P$1(E) R81.P$1(E) R97.1 R105.1 ; also sheet 1,2,3,4,6,7
LEVEL_ADC: C47.2 IC11.7(B:OUT) R92.1 ; also sheet 1,2,4
N$80: J21.P3 R82.2
N$81: C44.1 IC11.2(A:-IN) R82.1 R83.2 R84.1
N$82: R77.P$2(S) R84.2
N$83: J22.P3 R85.2
N$84: C45.1 IC11.13(D:-IN) R85.1 R86.2 R87.1
N$85: R81.P$2(S) R87.2
N$86: J23.P3 R88.2
N$87: C46.1 IC11.9(C:-IN) R88.1 R89.2 R90.1
N$88: R80.P$2(S) R90.2
N$89: J24.P3 R91.2
N$90: C47.1 IC11.6(B:-IN) R91.1 R92.2 R93.1
N$91: J19.P3 R94.2
N$92: C48.1 IC12.2(A:-IN) R94.1 R95.2 R96.1
N$93: R78.P$2(S) R96.2
N$94: R78.P$1(E) R97.2
N$95: J20.P3 R98.2
N$96: C49.1 IC12.6(B:-IN) R98.1 R99.2 R100.1
N$97: C53.2 IC13.3(A:+IN) IC13.6(B:-IN) IC13.7(B:OUT)
N$98: C52.1 IC13.5(B:+IN) R102.1
N$99: C53.1 R101.1 R102.2
N$100: IC13.2(A:-IN) R104.2 R105.2
N$101: C55.2 IC14.6(B:-IN) IC14.7(B:OUT) R110.2
N$102: C54.1 IC14.5(B:+IN) R107.1
N$103: C55.1 R106.1 R107.2
N$104: J20.P2 R113.1
N$106: IC13.1(A:OUT) R103.2 R104.1
N$107: R111.1(A) R112.2
N$108: J24.P2 R114.2
OUT_BI2: J26.P3 R108.1 ; also sheet 2
OUT_UNI2: J25.P3 R103.1 ; also sheet 2
PROC_ADC: C46.2 IC11.8(C:OUT) R89.1 ; also sheet 1,2,4
SHAPE_ADC: C44.2 IC11.1(A:OUT) R83.1 ; also sheet 1,2,4
UNI: R101.2 ; also sheet 1,2,4
VCC: C56.1 C57.1 IC13.8(P:V+) IC14.8(P:V+) R114.1 ; also sheet 1,2,3,4,6,7
VEE: C58.2 C59.2 IC13.4(P:V-) IC14.4(P:V-) ; also sheet 2,3,6,7
VOCT_ADC: C48.2 IC12.1(A:OUT) R95.1 ; also sheet 1,2,4
VOCT_IN: J19.P2 ; also sheet 2
Unconnected: J21.P2 J22.P2 J23.P2 J25.P2 J26.P2

### Notes on the sheet
- +8V
- 240k for balancing
- +/-5V
- cc-by-sa | Analog Section
- Emilie Gillet
- ol.gillet@gmail.com

## Sheet 6 of 7
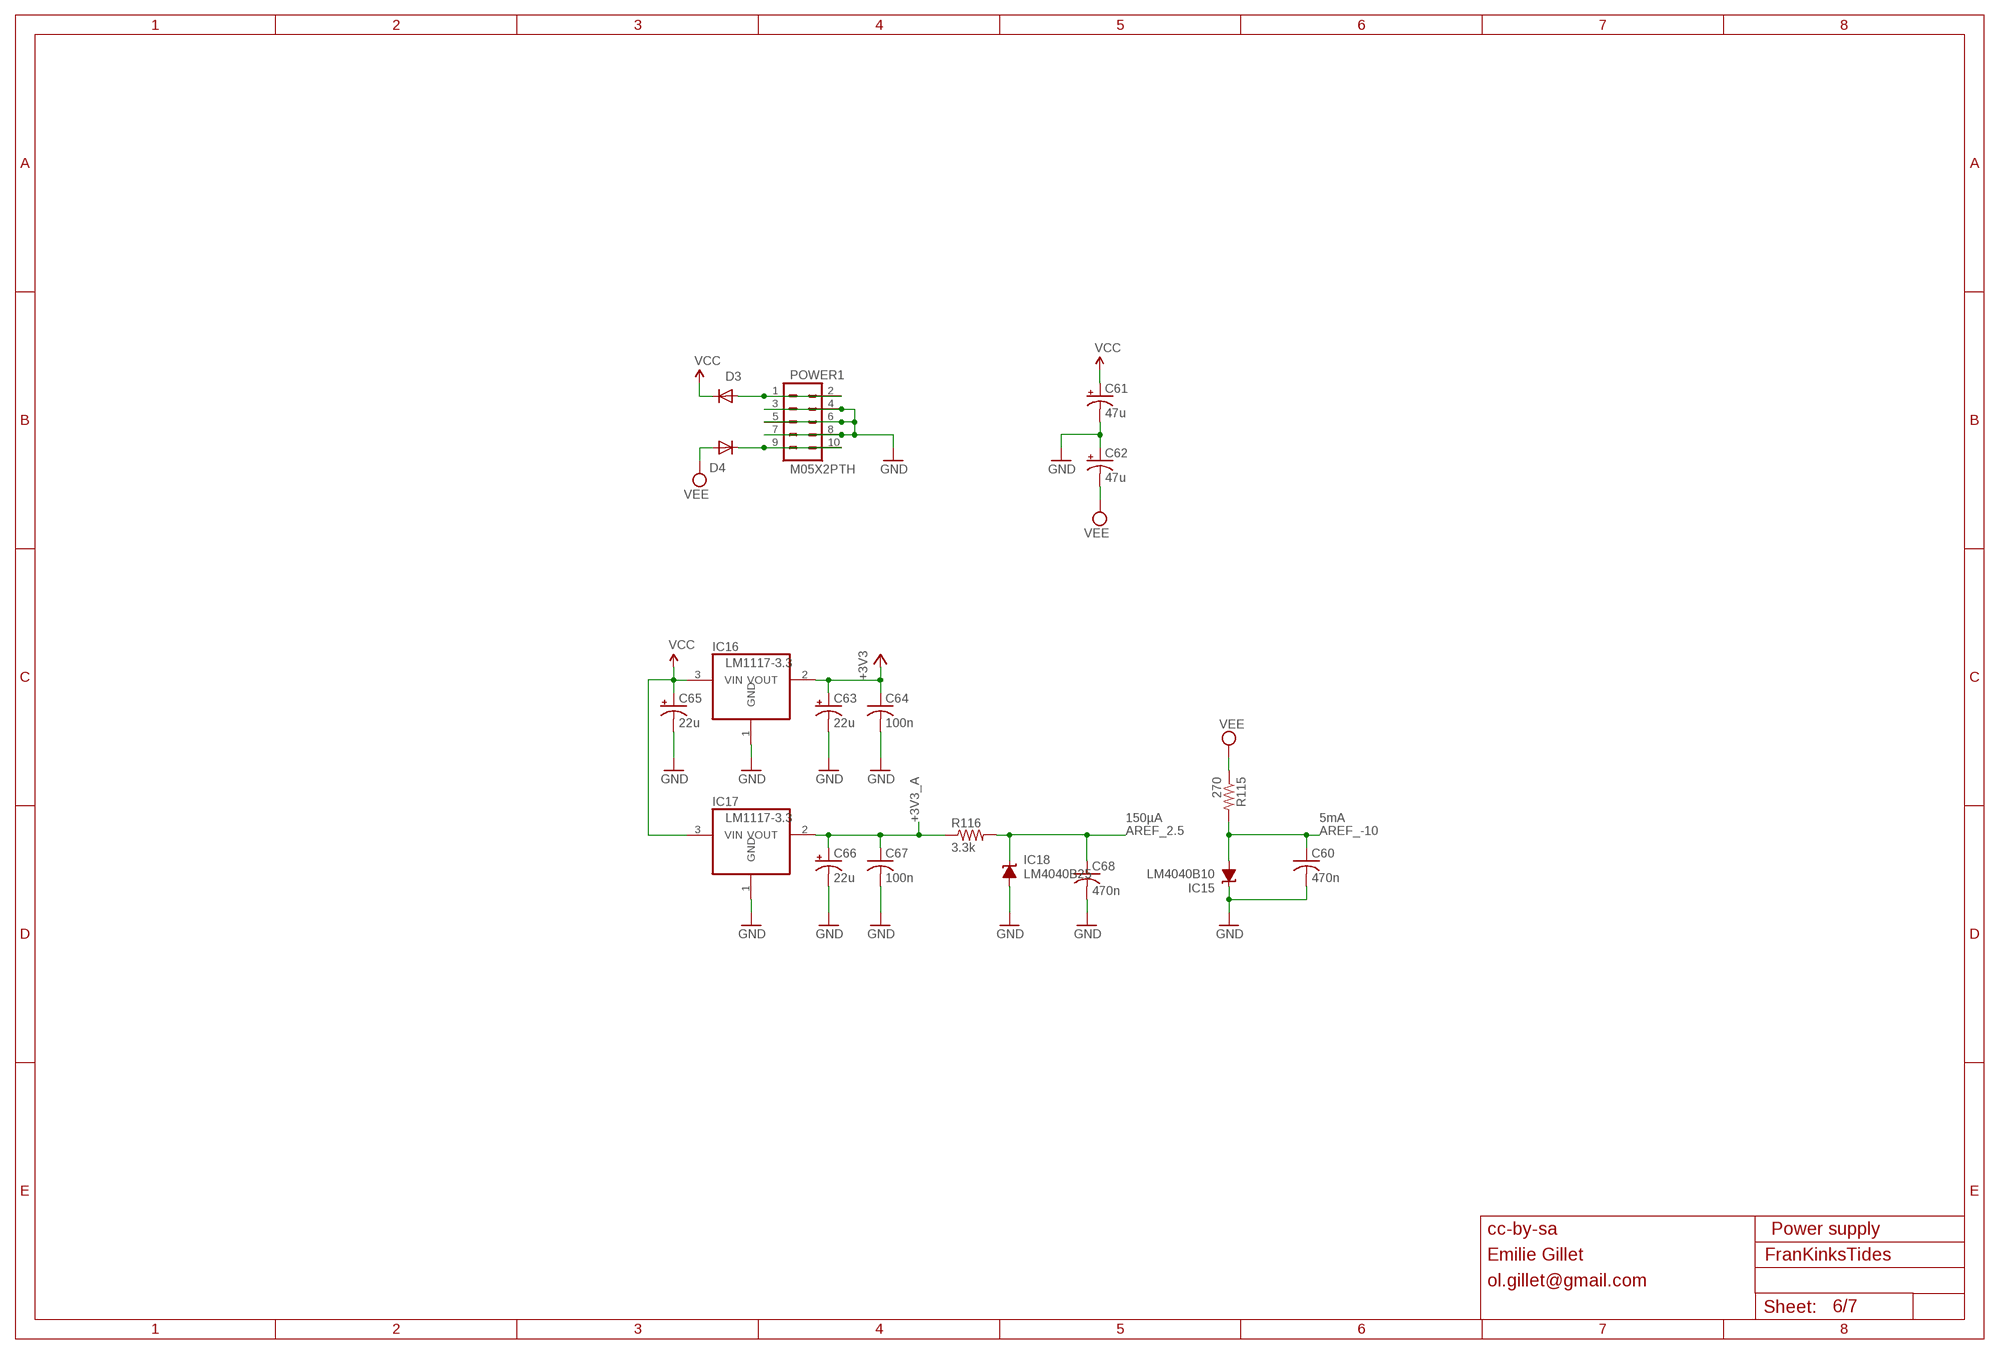
[diagram p5: schematic, sheet 6]

### Parts
C60  470n  C-USC0603  [C0603]
C61  47u  CPOL-USD  [PANASONIC_D]
C62  47u  CPOL-USD  [PANASONIC_D]
C63  22u  CPOL-USC  [PANASONIC_C]
C64  100n  C-USC0603  [C0603]
C65  22u  CPOL-USC  [PANASONIC_C]
C66  22u  CPOL-USC  [PANASONIC_C]
C67  100n  C-USC0603  [C0603]
C68  470n  C-USC0603  [C0603]
D3  1N5819HW  DIODE-SOD123  [SOD123]
D4  1N5819HW  DIODE-SOD123  [SOD123]
IC15  LM4040B10  LM4041B12DBZ  [DBZ_R-PDSO-G3]
IC16  LM1117-3.3  REG1117  [SOT223]
IC17  LM1117-3.3  REG1117  [SOT223]
IC18  LM4040B25  LM4041B12DBZ  [DBZ_R-PDSO-G3]
POWER1  M05X2PTH  [AVR_ICSP]
R115  270  R-US_R0603  [R0603]
R116  3.3k  R-US_R0603  [R0603]

### Nets
+3V3: C63.+ C64.1 IC16.2(VOUT) ; also sheet 1,3,4
+3V3_A: C66.+ C67.1 IC17.2(VOUT) R116.1 ; also sheet 1,2,3,4,5
AREF_2.5: C68.1 IC18.1(C) R116.2 ; also sheet 1,3,4
AREF_-10: C60.1 IC15.2(A) R115.2 ; also sheet 2,3,5
GND: C60.2 C61.- C62.+ C63.- C64.2 C65.- C66.- C67.2 C68.2 IC15.1(C) IC16.1(GND) IC17.1(GND) IC18.2(A) POWER1.3 POWER1.4 POWER1.5 POWER1.6 POWER1.7 POWER1.8 ; also sheet 1,2,3,4,5,7
N$109: D3.A POWER1.1 POWER1.2
N$110: D4.C POWER1.9 POWER1.10
VCC: C61.+ C65.+ D3.C IC16.3(VIN) IC17.3(VIN) ; also sheet 1,2,3,4,5,7
VEE: C62.- D4.A R115.1 ; also sheet 2,3,5,7

### Notes on the sheet
- 150µA | 5mA
- cc-by-sa | Power supply
- Emilie Gillet
- ol.gillet@gmail.com

## Sheet 7 of 7
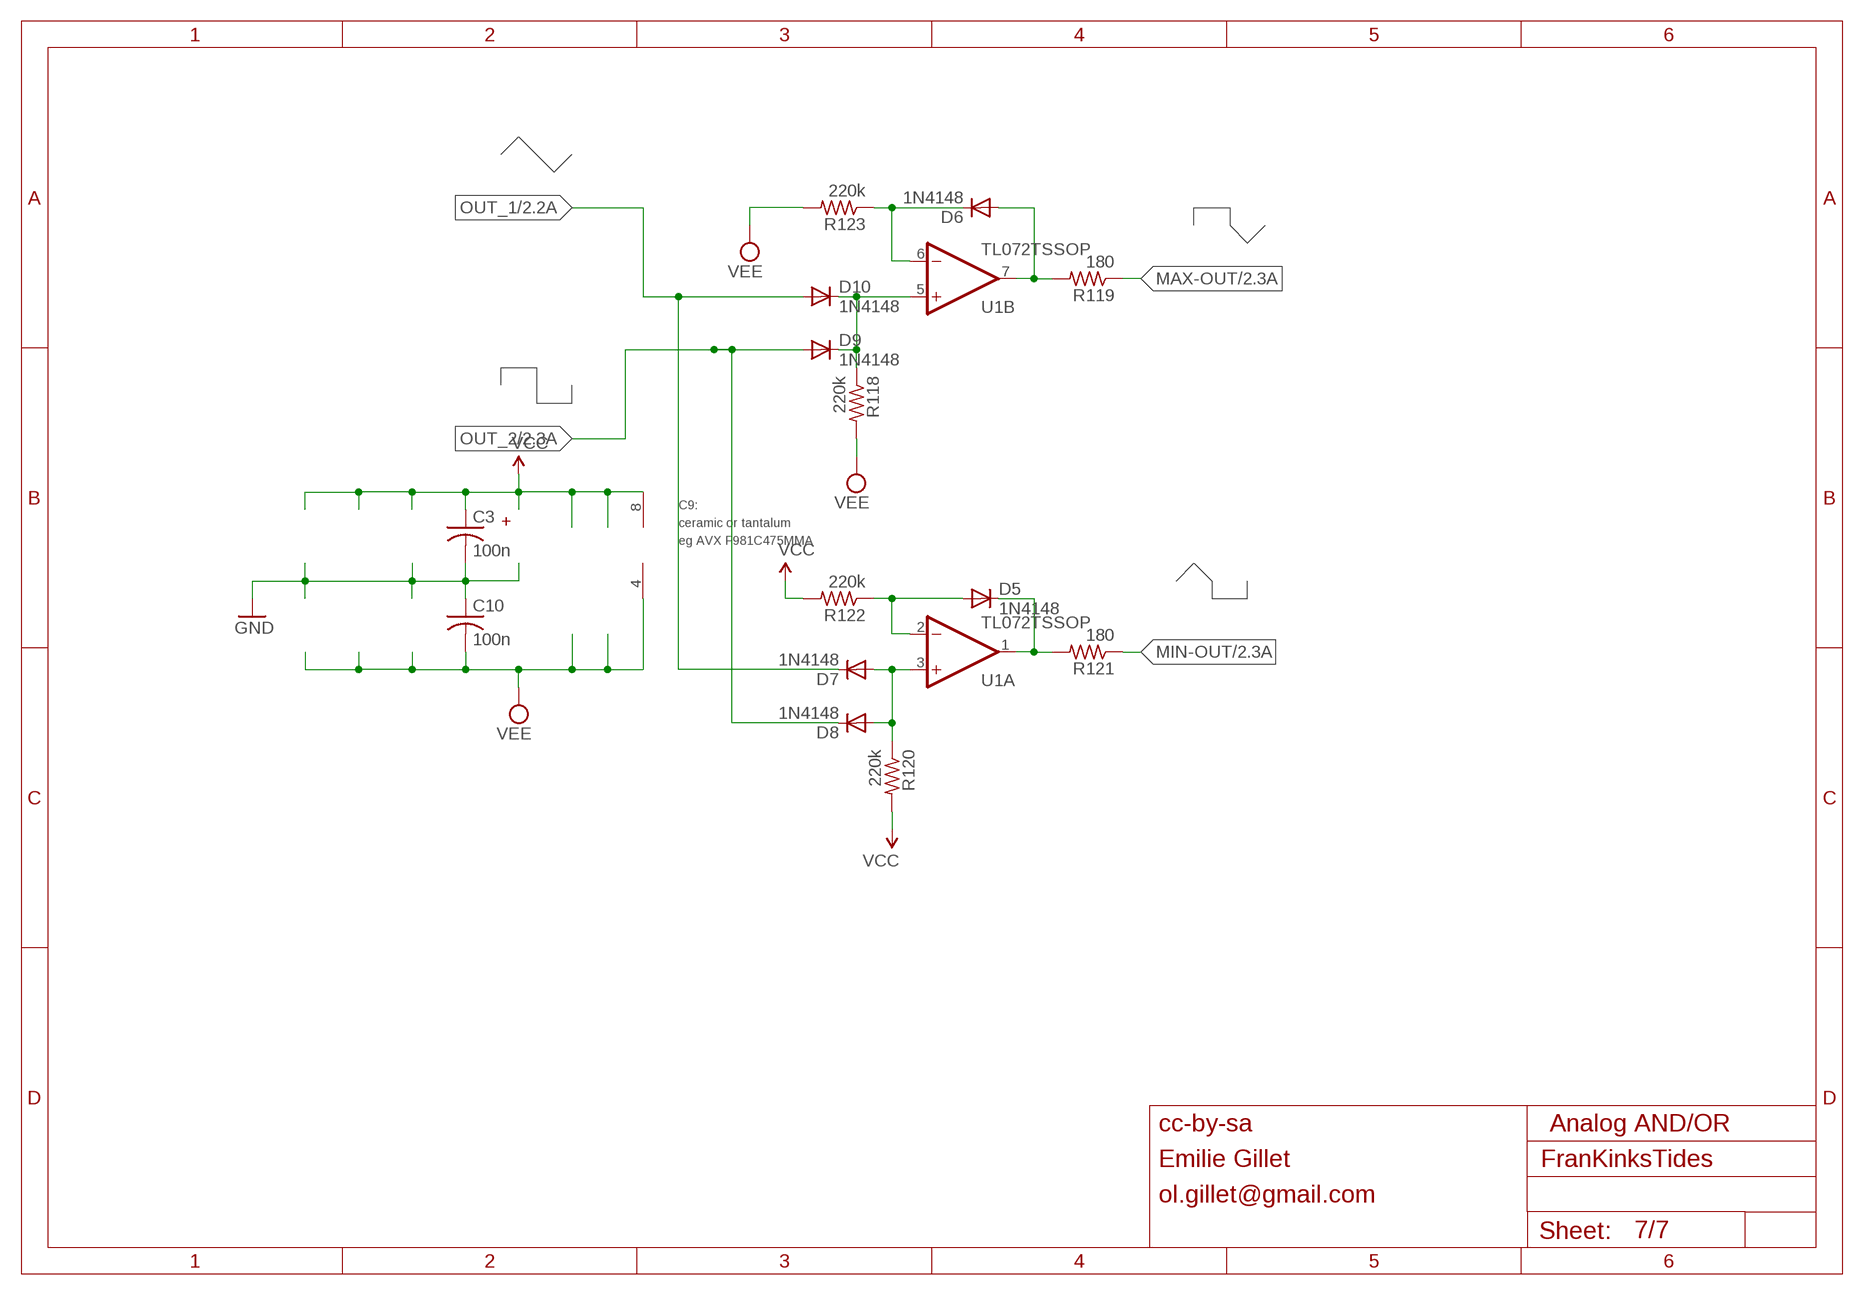
[diagram p6: schematic, sheet 7]

### Parts
C3  100n  C-USC0603  [C0603]
C10  100n  C-USC0603  [C0603]
D5  1N4148  DIODE-SOD123  [SOD123]
D6  1N4148  DIODE-SOD123  [SOD123]
D7  1N4148  DIODE-SOD123  [SOD123]
D8  1N4148  DIODE-SOD123  [SOD123]
D9  1N4148  DIODE-SOD123  [SOD123]
D10  1N4148  DIODE-SOD123  [SOD123]
R118  220k  R-US_R0603  [R0603]
R119  180  R-US_R0603  [R0603]
R120  220k  R-US_R0603  [R0603]
R121  180  R-US_R0603  [R0603]
R122  220k  R-US_R0603  [R0603]
R123  220k  R-US_R0603  [R0603]
U1  TL072TSSOP  [TSSOP-8]

### Nets
GND: C3.2 C10.1 ; also sheet 1,2,3,4,5,6
MAX-OUT: R119.1 ; also sheet 2
MIN-OUT: R121.1 ; also sheet 2
N$54: D9.C D10.C R118.1 U1.5(B:+IN)
N$56: D6.A R119.2 U1.7(B:OUT)
N$105: D6.C R123.1 U1.6(B:-IN)
N$111: D7.A D8.A R120.1 U1.3(A:+IN)
N$112: D5.C R121.2 U1.1(A:OUT)
N$113: D5.A R122.1 U1.2(A:-IN)
OUT_1: D7.C D10.A ; also sheet 2
OUT_2: D8.C D9.A ; also sheet 2
VCC: C3.1 R120.2 R122.2 U1.8(P:V+) ; also sheet 1,2,3,4,5,6
VEE: C10.2 R118.2 R123.2 U1.4(P:V-) ; also sheet 2,3,5,6

### Notes on the sheet
- C9:
- + | ceramic or tantalum
- eg AVX F981C475MMA
- cc-by-sa | Analog AND/OR
- Emilie Gillet
- ol.gillet@gmail.com

## Library data of the parts
C1 C8 C9 C61-C63 C65 C66 = rcl:CPOL-US: POLARIZED CAPACITOR, American symbol
C2-C7 C10-C60 C64 C67 C68 = rcl:C-US: CAPACITOR, American symbol
D3-D10 = diode:DIODE-: DIODE
FM-A SYNC-B = Mangu:SUBMINI_SPDT
IC1 IC3 IC16 IC17 = og-vreg:REG1117: 800mA and 1A Low Dropout (LDO) Positive Regulator 1.8V, 2.5V, 2.85V, 3.3V, 5V, and Adj
IC2 IC7 IC15 IC18 = texas:LM4041: PRECISION MICROPOWER SHUNT VOLTAGE REFERENCE Source: http://focus.ti.com/lit/ds/slcs146e/slcs146e.pdf
IC4 IC10 = og-dac:DAC8552
IC5 IC6 IC13 IC14 = MusicThingModular:TL072: Generic Dual Op Amp
IC8 IC12 = linear:TL072: OP AMP
IC9 IC11 = linear:MCP6004: Quad Op Amp
J1-J26 J30 MAX MIN MIX = MILibuTides5:PJ301_GUI
JTAG JTAG1 POWER1 = og-header:M05X2: Header 5x2 Standard 10-pin dual row 0.1" header. Commonly used with AVR-ISP. Use with Spark Fun Electronics SKU: PRT-00778
LED1-LED6 = og-leds:LED-BICOLOR-THROUGHHOLE
Q1 Q7 = SparkFun-Clocks:CRYSTAL-8MHZ: 8MHz Crystal Datasheet Example <http://www.futureelectronics.com/en/technologies/electromechanical/timing-devices/crystals/Pages/6008189-ABM3B-8.000MHZ-B2-T.aspx?IM=0> Frequency: 8MHz Frequency Tolerance: ±20ppm Load Capacitance: 18pF SparkFun Products: Pro Micro -3.3V/8MHz <https://www.sparkfun.com/products/12587> WAV Trigger <https://www.sparkfun.com/products/13660>; PROD_ID: XTAL-11706
Q2-Q6 Q8-Q12 = transistor:*-NPN-: NPN Transistror BF959 corrected 2008.03.06
R1-R4 R7-R16 R20-R58 R60-R76 R82-R110 R112-R116 R118-R123 = rcl:R-US_: RESISTOR, American symbol
R5 R78 R117 = pot-alps:POT_US
R6 R17-R19 R77 R79-R81 = MILibuTides5:POT-ALPS_POT_US
R59 R111 = rcl:R-TRIMM: Trimm resistor
SW1-SW4 = switch-e-switch:TL1100X: TACTILE SWITCH
SYNC-A UNI-BI = switch:TL49PO: TINY SWITCH ON OFF ON Source: http://www2.produktinfo.conrad.com/datenblaetter/700000-724999/705152-da-01-de-Subminiaturschalter_TL_36YO.pdf
U1 = Mangu:TL072: Generic Dual Op Amp
UC1 UC2 = stm32:STM32F103CB